# Altium schematic sheet Sheet.SchDoc: Ultrasonic Distance Meter
size A3; Date: 29.08.2025; Author: Olexandr Makedonskyi; CompanyName: AJAX; DrawnBy: Olexandr Makedonskyi; DocumentNumber: 1; Revision: 1.0; SheetNumber: 1; SheetTotal: 1
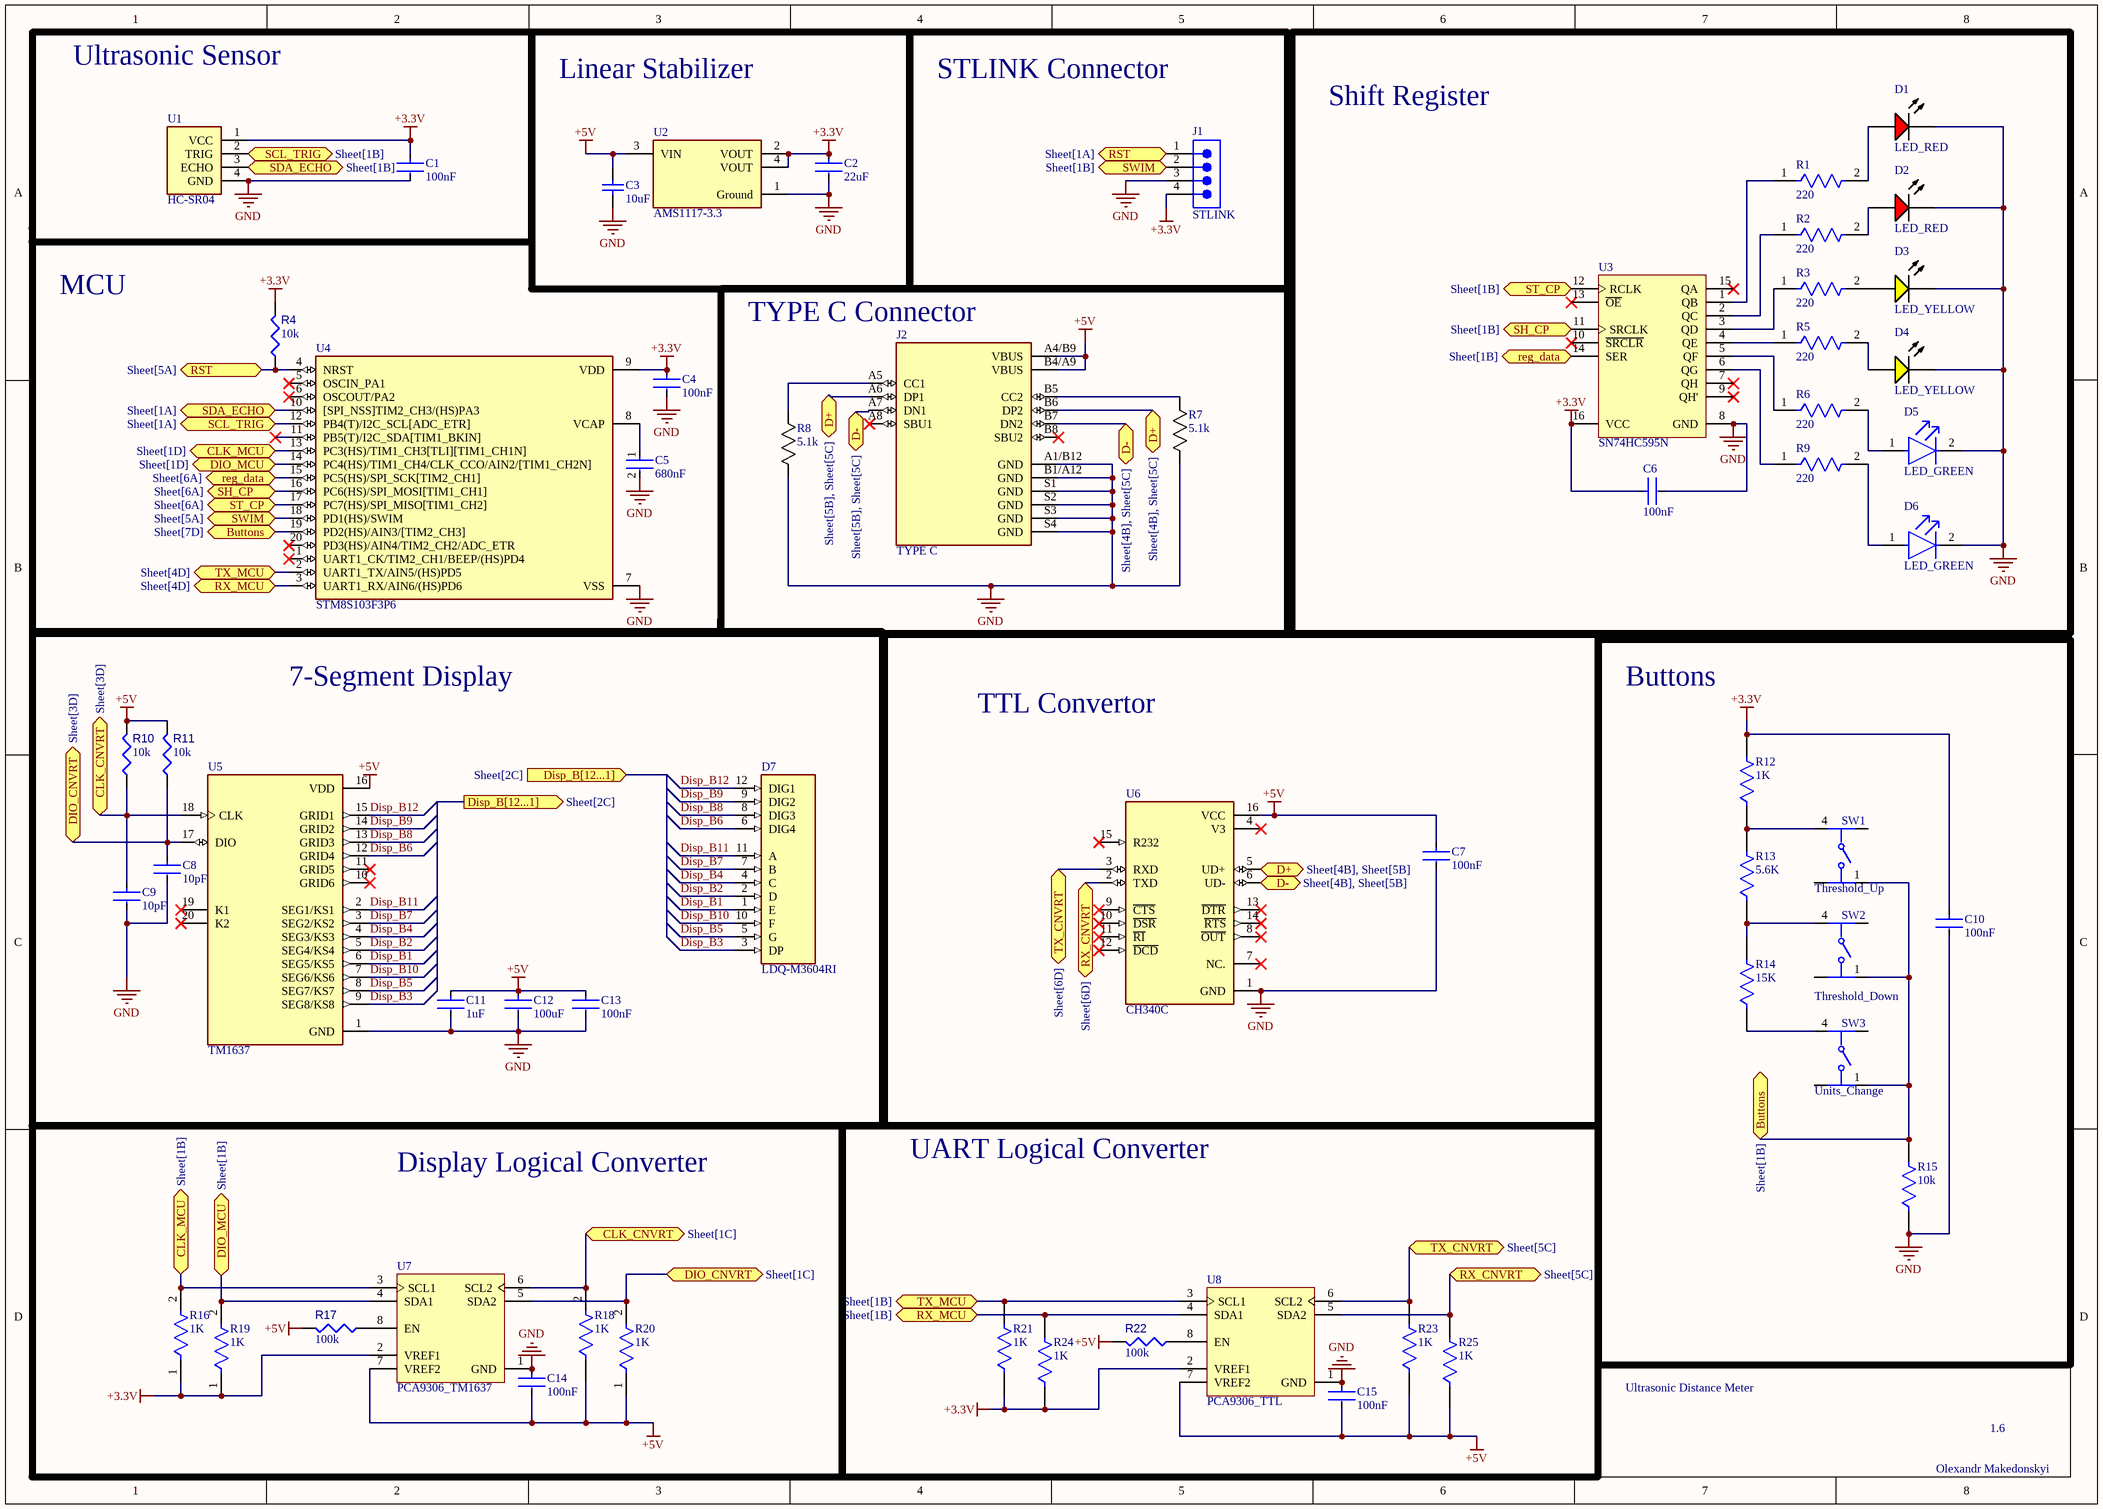
[diagram p0: Sheet.SchDoc]

## Parts
C1  100nF  [FP-C1206C-EB-MFG]
C2  22uF  [FP-1206-L_3_2_0_2-W_1_6_0-IPC_A]
C3  10uF  [CAPC1206(3216)190_L]
C4  100nF  [FP-C1206C-EB-MFG]
C5  680nF  [FP-CC1206-1_25-MFG]
C6  100nF  [FP-C1206C-EB-MFG]
C7  100nF  [FP-C1206C-EB-MFG]
C8  10pF  [FP-1206-L_3_2_0_2-W_1_6_0-IPC_C]
C9  10pF  [FP-1206-L_3_2_0_2-W_1_6_0-IPC_C]
C10  100nF  [FP-C1206C-EB-MFG]
C11  1uF  [FP-CC1206-FA-IPC_A]
C12  100uF  [FP-GRM31C-0_3-e0_3_0_8-MFG]
C13  100nF  [FP-C1206C-EB-MFG]
C14  100nF  [FP-C1206C-EB-MFG]
C15  100nF  [FP-C1206C-EB-MFG]
D1  LED_RED  [LUMX-SML-LX1206IC_V]
D2  LED_RED  [LUMX-SML-LX1206IC_V]
D3  LED_YELLOW  [LUMX-SML-LX1206YC-TR_V]
D4  LED_YELLOW  [LUMX-SML-LX1206YC-TR_V]
D5  LED_GREEN  [FP-SML-LX1206GC-TR-MFG]
D6  LED_GREEN  [FP-SML-LX1206GC-TR-MFG]
D7  LDQ-M3604RI  [LED_LDQ-M3604RI]
J1  STLINK  [61300411021]
J2  TYPE C  [GCT_USB4110GFA]
R1  220  [FP-SR1206-MFG]
R2  220  [FP-SR1206-MFG]
R3  220  [FP-SR1206-MFG]
R4  value 10k  [RESC3216X60X45ML15T20]  (hidden comment: Resistor 10k +/-1% 1206 250 mW)
R5  220  [FP-SR1206-MFG]
R6  220  [FP-SR1206-MFG]
R7  5.1k  [MCA 1206_VIS]
R8  5.1k  [MCA 1206_VIS]
R9  220  [FP-SR1206-MFG]
R10  value 10k  [RESC3216X60X45ML15T20]  (hidden comment: Resistor 10k +/-1% 1206 250 mW)
R11  value 10k  [RESC3216X60X45ML15T20]  (hidden comment: Resistor 10k +/-1% 1206 250 mW)
R12  1K  [FP-RMCF1206-IPC_A]
R13  5.6K  [FP-ESR18-IPC_C]
R14  15K  [FP-CRGCQ1206-IPC_C]
R15  10k  [FP-MCA1206-IPC_B]
R16  1K  [FP-RMCF1206-IPC_A]
R17  value 100k  [RESC3216X60X45ML15T20]  (hidden comment: Resistor 100k +/-1% 1206 250 mW)
R18  1K  [FP-RMCF1206-IPC_A]
R19  1K  [FP-RMCF1206-IPC_A]
R20  1K  [FP-RMCF1206-IPC_A]
R21  1K  [FP-RMCF1206-IPC_A]
R22  value 100k  [RESC3216X60X45ML15T20]  (hidden comment: Resistor 100k +/-1% 1206 250 mW)
R23  1K  [FP-RMCF1206-IPC_A]
R24  1K  [FP-RMCF1206-IPC_A]
R25  1K  [FP-RMCF1206-IPC_A]
SW1  (no value)  [FP-MJTP1230A-MFG]
SW2  (no value)  [FP-MJTP1230A-MFG]
SW3  (no value)  [FP-MJTP1230A-MFG]
U1  HC-SR04  [MODULE_4007]
U2  AMS1117-3.3  [FP-AMS1117-IPC_C]
U3  SN74HC595N  [DB0016A_M]
U4  STM8S103F3P6  [SOP65P640X120-20N]
U5  TM1637  [DIP778W43P254L2612H431Q20N]
U6  CH340C  [SOIC127P600X180-16N]
U7  PCA9306_TM1637  [DCT0008A_L]
U8  PCA9306_TTL  [DCT0008A_L]

## Blocks framed on the sheet
Ultrasonic Sensor: C1 U1
Linear Stabilizer: C2 C3 U2
STLINK Connector: J1
Shift Register: C6 D1-D6 R1-R3 R5 R6 R9 U3
TYPE C Connector: J2 R7 R8
7-Segment Display: C8 C9 C11-C13 D7 R10 R11 U5
TTL Convertor: C7 U6
Buttons: C10 R12-R15 SW1-SW3
Display Logical Converter: C14 R16-R20 U7
UART Logical Converter: C15 R21-R25 U8

## Ports
Buttons (bidir, see Sheet[1B]), Buttons (bidir, see Sheet[7D]), CLK_CNVRT (bidir, see Sheet[1C]), CLK_CNVRT (bidir, see Sheet[3D]), CLK_MCU (bidir, see Sheet[1B]), CLK_MCU (bidir, see Sheet[1D]), D+ (bidir, see Sheet[4B], Sheet[5B]), D+ (bidir, see Sheet[4B], Sheet[5C]), D+ (bidir, see Sheet[5B], Sheet[5C]), D- (bidir, see Sheet[4B], Sheet[5B]), D- (bidir, see Sheet[4B], Sheet[5C]), D- (bidir, see Sheet[5B], Sheet[5C]), DIO_CNVRT (bidir, see Sheet[1C]), DIO_CNVRT (bidir, see Sheet[3D]), DIO_MCU (bidir, see Sheet[1B]), DIO_MCU (bidir, see Sheet[1D]), Disp_B[12...1] (in, see Sheet[2C]), Disp_B[12...1] (out, see Sheet[2C]), reg_data (bidir, see Sheet[1B]), reg_data (bidir, see Sheet[6A]), RST (bidir, see Sheet[1A]), RST (bidir, see Sheet[5A]), RX_CNVRT (bidir, see Sheet[5C]), RX_CNVRT (bidir, see Sheet[6D]), RX_MCU (bidir, see Sheet[1B]), RX_MCU (bidir, see Sheet[4D]), SCL_TRIG (bidir, see Sheet[1A]), SCL_TRIG (bidir, see Sheet[1B]), SDA_ECHO (bidir, see Sheet[1A]), SDA_ECHO (bidir, see Sheet[1B]), SH_CP (bidir, see Sheet[1B]), SH_CP (bidir, see Sheet[6A]), ST_CP (bidir, see Sheet[1B]), ST_CP (bidir, see Sheet[6A]), SWIM (bidir, see Sheet[1B]), SWIM (bidir, see Sheet[5A]), TX_CNVRT (bidir, see Sheet[5C]), TX_CNVRT (bidir, see Sheet[6D]), TX_MCU (bidir, see Sheet[1B]), TX_MCU (bidir, see Sheet[4D])

## Nets
+3.3V: C1.1 C2.1 C4.1 C6.1 C10.1 J1.4 R4.2 R12.2 R16.1 R19.1 R21.1 R24.1 U1.1(VCC) U2.2(VOUT) U2.4(VOUT) U3.16(VCC) U4.9(VDD) U7.2(VREF1) U8.2(VREF1)
+5V: C3.2 C7.1 C11.1 C12.2 C13.1 C14.2 C15.2 J2.A4/B9(VBUS) J2.B4/A9(VBUS) R10.2 R11.2 R17.2 R18.1 R20.1 R22.2 R23.1 R25.1 U2.3(VIN) U5.16(VDD) U6.16(VCC) U7.7(VREF2) U8.7(VREF2)
GND: C1.2 C2.2 C3.1 C4.2 C5.2 C6.2 C7.2 C8.2 C9.2 C10.2 C11.2 C12.1 C13.2 C14.1 C15.1 D1.2(K) D2.2(K) D3.2(K) D4.2(K) D5.2(C) D6.2(C) J1.3 J2.A1/B12(GND) J2.B1/A12(GND) J2.S1(GND) J2.S2(GND) J2.S3(GND) J2.S4(GND) R7.1 R8.1 R15.1 U1.4(GND) U2.1(Ground) U3.8(GND) U4.7(VSS) U5.1(GND) U6.1(GND) U7.1(GND) U8.1(GND)
Buttons: R15.2 SW1.1 SW2.1 SW3.1 U4.19(PD2(HS)/AIN3/[TIM2_CH3]) ; port Buttons
CLK_CNVRT: C9.1 R10.1 R18.2 U5.18(CLK) U7.6(SCL2) ; port CLK_CNVRT
CLK_MCU: R16.2 U4.13(PC3(HS)/TIM1_CH3[TLI][TIM1_CH1N]) U7.3(SCL1) ; port CLK_MCU
D+: J2.A6(DP1) J2.B6(DP2) U6.5(UD+) ; port D+
D-: J2.A7(DN1) J2.B7(DN2) U6.6(UD-) ; port D-
DIO_CNVRT: C8.1 R11.1 R20.2 U5.17(DIO) U7.5(SDA2) ; port DIO_CNVRT
DIO_MCU: R19.2 U4.14(PC4(HS)/TIM1_CH4/CLK_CCO/AIN2/[TIM1_CH2N]) U7.4(SDA1) ; port DIO_MCU
Disp_B1: D7.1(E) U5.6(SEG5/KS5)
Disp_B2: D7.2(D) U5.5(SEG4/KS4)
Disp_B3: D7.3(DP) U5.9(SEG8/KS8)
Disp_B4: D7.4(C) U5.4(SEG3/KS3)
Disp_B5: D7.5(G) U5.8(SEG7/KS7)
Disp_B6: D7.6(DIG4) U5.12(GRID4)
Disp_B7: D7.7(B) U5.3(SEG2/KS2)
Disp_B8: D7.8(DIG3) U5.13(GRID3)
Disp_B9: D7.9(DIG2) U5.14(GRID2)
Disp_B10: D7.10(F) U5.7(SEG6/KS6)
Disp_B11: D7.11(A) U5.2(SEG1/KS1)
Disp_B12: D7.12(DIG1) U5.15(GRID1)
reg_data: U3.14(SER) U4.15(PC5(HS)/SPI_SCK[TIM2_CH1]) ; port reg_data
RST: J1.1 R4.1 U4.4(NRST) ; port RST
RX_CNVRT: R25.2 U6.2(TXD) U8.5(SDA2) ; port RX_CNVRT
RX_MCU: R24.2 U4.3(UART1_RX/AIN6/(HS)PD6) U8.4(SDA1) ; port RX_MCU
SCL_TRIG: U1.2(TRIG) U4.12(PB4(T)/I2C_SCL[ADC_ETR]) ; port SCL_TRIG
SDA_ECHO: U1.3(ECHO) U4.10([SPI_NSS]TIM2_CH3/(HS)PA3) ; port SDA_ECHO
SH_CP: U3.11(SRCLK) U4.16(PC6(HS)/SPI_MOSI[TIM1_CH1]) ; port SH_CP
ST_CP: U3.12(RCLK) U4.17(PC7(HS)/SPI_MISO[TIM1_CH2]) ; port ST_CP
SWIM: J1.2 U4.18(PD1(HS)/SWIM) ; port SWIM
TX_CNVRT: R23.2 U6.3(RXD) U8.6(SCL2) ; port TX_CNVRT
TX_MCU: R21.2 U4.2(UART1_TX/AIN5/(HS)PD5) U8.3(SCL1) ; port TX_MCU
NetC5_1: C5.1 U4.8(VCAP)
NetD1_1: D1.1(A) R1.2
NetD2_1: D2.1(A) R2.2
NetD3_1: D3.1(A) R3.2
NetD4_1: D4.1(A) R5.2
NetD5_1: D5.1(A) R6.2
NetD6_1: D6.1(A) R9.2
NetJ2_A5: J2.A5(CC1) R8.2
NetJ2_B5: J2.B5(CC2) R7.2
NetR1_1: R1.1 U3.1(QB)
NetR2_1: R2.1 U3.2(QC)
NetR3_1: R3.1 U3.3(QD)
NetR5_1: R5.1 U3.4(QE)
NetR6_1: R6.1 U3.5(QF)
NetR9_1: R9.1 U3.6(QG)
NetR12_1: R12.1 R13.2 SW1.4
NetR13_1: R13.1 R14.2 SW2.4
NetR14_1: R14.1 SW3.4
NetR17_1: R17.1 U7.8(EN)
NetR22_1: R22.1 U8.8(EN)

Not connected (* = marked no-connect by the designer): J2 A8(SBU1)* B8(SBU2)*; SW1 2 3; SW2 2 3; SW3 2 3; U3 7(QH)* 9(QH')* 10(~{SRCLR})* 13(~{OE})* 15(QA)*; U4 1(UART1_CK/TIM2_CH1/BEEP/(HS)PD4)* 5(OSCIN_PA1)* 6(OSCOUT/PA2)* 11(PB5(T)/I2C_SDA[TIM1_BKIN])* 20(PD3(HS)/AIN4/TIM2_CH2/ADC_ETR)*; U5 10(GRID6)* 11(GRID5)* 19(K1)* 20(K2)*; U6 4(V3)* 7(NC.)* 8(~{OUT})* 9(~{CTS})* 10(~{DSR})* 11(~{RI})* 12(~{DCD})* 13(~{DTR})* 14(~{RTS})* 15(R232)*

## Notes on the sheet
- MCU
- (near SW1) Threshold_Up
- (near SW2) Threshold_Down
- (near SW3) Units_Change
- Ultrasonic Distance Meter
- 1.6
- Olexandr Makedonskyi

## Library data of the parts
C1 C4 C6 C7 C10 C13-C15 = CMP-03020-029382-1: C1206 0.10 μF X8R 2.00% 16 V; Manufacturer Part Number: C1206C104G4HACAUTO; Manufacturer: KEMET; Automotive Grade: Grade 0; Capacitance: 0.10 μF; Voltage Rating: 16 V; Value: 0.10 μF; Temperature Coefficient: 15%; Tolerance: 0.02; Material: Ceramic; Device Class L3: Ceramic Capacitors; Lead Free: Yes; Ipc Land Pattern Name: CAPC320160X78; RoHS: TRUE; Automotive: Yes; Package: C1206C-EB; Octopart: https://octopart.com/c1206c104g4hacauto-kemet-88099309; Temperature Range Low: -55°C; ComponentLink2URL: https://content.kemet.com/datasheets/KEM_C1007_X8R_ULTRA_150C_SMD.pdf; Device Class L2: Capacitors; Temperature: -55°C to +150°C; ComponentLink2Description: Datasheet; Category: Cap; Temperature Range High: +150°C; Device Class L1: Passive Components; Height: 0.88mm; Temperature Characteristic: X8R
C2 = CMP-04427-020232-1: General Purpose Ceramic Capacitor, 1206, 22uF, 20%, X7R, 15%, 6.3V; Dissipation Factor: 5%; Width: 0.063inch; Min Operating Temperature: -55°C; Mount: Surface Mount; Case Code (Metric): 3216; Case/Package: 1206; Voltage Rating (DC): 6.3V; Package Quantity: 2500; RoHS Compliant: Yes; Depth: 1.6mm; Termination: SMD/SMT; Length: 3.2mm; Radiation Hardening: No; Max Operating Temperature: 125°C; Packaging: Tape and Reel; Voltage Rating: 6.3V; Construction: Flat; REACH SVHC: No SVHC; Case Code (Imperial): 1206; Lead Free: Lead Free; Height: 1.78mm; Capacitance: 22uF; Tolerance: 20%; Dielectric: X7R; Thickness: 0.07inch; Number of Pins: 2
C3 = CMP-1037-04978-1: CAP 10uF 16V -20% to +80% 1206 (3216 Metric) Thickness 1.9mm SMD; Case-EIA: 1206; Case-Metric: 3216; Tolerance: -20% to +80%; Technology: SMT; Value: 10uF; Rated Voltage: 16 V; Max Thickness: 1.9 mm
C5 = CMP-03422-000845-1: CAP CER 0.68UF 50V X7R 1206; Manufacturer: Yageo; Manufacturer Part Number: CC1206KKX7R9BB684; Automotive Grade: NA; Material: Ceramic; Tolerance: 0.1; Temperature Coefficient: 15%; Category: Cap; Footprint Url: http://www.yageo.com/exep/pages/download/literatures/UPY-C_GEN_24.pdf; Octopart: https://octopart.com/cc1206kkx7r9bb684-yageo-71334650; Device Class L2: Capacitors; Digikey Description: CAP CER 0.68UF 50V X7R 1206; Device Class L1: Passive Components; Temperature: -55°C to +125°C; Capacitance: 680 nF; Temperature Characteristic: X7R; ComponentLink2URL: http://www.yageo.com/documents/recent/UPY-NP0X7R_HV_1KV-to-3KV_11.pdf; Mouser Description: Cap Ceramic 0.68uF 50V X7R 10% Pad SMD 1206 125C T/R; Height: 1.45mm; Lead Free: Yes; Device Class L3: Ceramic Capacitors; ComponentLink2Description: Datasheet; Temperature Range High: +125°C; Package: CC1206-1.25; Voltage Rating: 50 V; Temperature Range Low: -55°C; Automotive: No; RoHS: TRUE; Value: 680 nF
C8 C9 = CMP-04427-003168-1: Automotive Ceramic Capacitor, 1206, 10pF, 5%, NP0, 30ppm/°C, 500V; Dielectric: C0G; Case/Package: 1206; Termination: SMD/SMT; Package Quantity: 4000; Max Operating Temperature: 125°C; Length: 3.2mm; RoHS Compliant: Yes; Height: 0.5mm; Tolerance: 5%; Capacitance: 10pF; Packaging: Tape and Reel; Case Code (Imperial): 1206; Voltage Rating: 500V; Width: 1.6mm; Voltage Rating (DC): 500V; Case Code (Metric): 3216; Min Operating Temperature: -55°C
C11 = CMP-03422-000449-2: CAP CER X5R 1206; RoHS Compliant: Yes
C12 = CMP-06035-034850-1: Chip Multilayer Ceramic Capacitors for General Purpose, 1206, 100uF, X5R, 15%, 20%, 6.3V
D1 D2 = CMP-2000-07123-1: LED Red, 65 mW, -40 to 85 degC, 2-Pin SMD, RoHS, Tape and Reel; Manufacturer: Lumex; Part No: SML-LX1206IC-TR; LED Material: GaAsP; Peak Wavelength: 635nm; Number of LEDs: 1; Viewing Angle: 160; Reverse Voltage: 5(Min)V; Lens Appearance: ColorlessNonDiffused; Intensity: 6mcd; Type: Uni-Color; Pin_Count: 2; Lens Dimensions: 2x1.6x0.5mm; Mounting: SurfaceMount; ECCN: EAR99; RoHS: Unknown; Package Description: 2-Pin Surface Mount Device, Body 3.2 x 1.5 mm; Mounting Technology: SurfaceMount; Dominant Wavelength: N/A; Supplier_Package: SMD; Supplier Standard Pack: 3,000; Color: Red; Dimension: 3.2x1.6x1.1mm; HTS: 8541402000; Family: SML-LX1206IC; Supplier: Lumex; Datasheet URL: http://www.lumex.com/content/files/ProductAttachment/SML-LX1206IC-TR.pdf; Package Reference: SML-LX1206IC; Manufacturer URL: http://www.lumexinstruments.com/; Operating Temperature: -25to85C; Packaging: TapeandReel; Datasheet Version: Rev. J, 08/2012
D3 D4 = CMP-2000-07124-1: Yellow LED, Water Clear Len, 585 nm, 2.1 V, -40 to 85 degC, 2-Pin SMD, RoHS, Tape and Reel; Manufacturer: Lumex; Product Training Modules: LEDsBenefitsofCustomLEDandLCDTechnology; Millicandela Rating: 6mcd; Catalog Drawings: SML-LX1206SeriesTopSML-LX1206SeriesSideSML-LX1206SeriesBottomSML-LX1206SeriesFootprint; Wavelength - Peak: 585nm; Other Names: 67-1358-2LU60357TRSMLLX1206YCTR; Lens Style/Size: RectanglewithFlatTop; Current - Test: 20mA; Lens Color: Colorless; Viewing Angle: 160°; Voltage - Forward (Vf) (Typ): 2.1V; Online Catalog: SML-LX1206RectanglewithFlatTop1206PackageLEDs; Mounting Type: SurfaceMount; Package Description: 2-Pin Surface Mount Device, Body 3.2 x 1.5 mm; Datasheet Version: Rev. K, 08/2012; Features: -; Color: Yellow; RoHS Information: RoHSCertofCompliance; Package Reference: SML-LX1206YC-TR; Supplier Device Package: 1206; Standard Package: 3,000; Series: -; Wavelength - Dominant: -; Package / Case: 1206(3216Metric); Mounting Technology: SurfaceMount; Height (Max): 1.10mm; Lens Transparency: Clear; Datasheet URL: http://www.lumex.com/content/files/ProductAttachment/SML-LX1206YC-TR.pdf; Family: LEDIndication-Discrete; Manufacturer URL: http://www.lumexinstruments.com/; Packaging: Tape&Reel(TR); Category: Optoelectronics; Size / Dimension: 3.20mmLx1.60mmW
D5 D6 = CMP-2000-07122-2: LED GREEN CLEAR 1206 SMD; Test Current: 20mA; Luminous Intensity: 10mcd; Forward Voltage: 2.2V; Viewing Angle: 160°; Lens Color: Colorless; Approvals: UL; Dominant Wavelength: 565nm; Current Rating: 25mA; Number of LEDs: 1; Power Rating: 65mW; Lens Style: Rectangular; Length: 3.2mm; Mount: Surface Mount; Package Quantity: 1; Forward Current: 20mA; Case/Package: 1206; Lead Free: Lead Free; Case Code (Imperial): 1206; Max Operating Temperature: 85°C; REACH SVHC: No SVHC; RoHS Compliant: Yes; Number of Pins: 2; Illumination Color: Green; Width: 1.6mm; Packaging: Tape and Reel; Wavelength: 565nm; Lens Transparency: Clear; Height: 1.1mm; Color: Green; Min Operating Temperature: -40°C; Case Code (Metric): 3216
D7 = CMP-004-00032-1: Display, Seven Segment, 9.2MM, Red; MF: Lumex; Value: *; Pins: 12; Source: LDQ-M3604RI.SchLib; MP: LDQ-M3604RI; SnapEDA_Link: https://www.snapeda.com/parts/LDQ-M3604RI/Lumex/view-part/?ref=snap; Component Type: Standard; Case/Package: None; Design Item ID: LDQ-M3604RI; Check_prices: https://www.snapeda.com/parts/LDQ-M3604RI/Lumex/view-part/?ref=eda
J1 = CMP-007-000000-1: NexarPartId: 31153320; Number of Positions: 4; Connector Type: Male Pin; Gender: Male; Current Rating: 3A; Pitch: 2.54mm; Contact Resistance: 20m?; Operating Supply Voltage: 250V; REACH SVHC: Unknown; Contact Mating Length: 5.9944mm; Termination: Solder; Pin Count: 4; Mount: Through Hole; Number of Rows: 1; Number of Pins: 4; Contact Material: Copper; Color: Black; Contact Plating: Gold; Design Item ID: CMP-1502-01063-3; Component Type: Standard; Source: Components - 25.08.25 - 11.48.SchLib; RoHS: Compliant; Lead Pitch: 2.54mm; Number of Contacts: 4
J2 = CMP-002-00071-1: USB-C (USB TYPE-C) USB 2.0 Receptacle Connector 24 (16+8 Dummy) Position Surface Mount, Right Angle; MF: Global Connector Technology; Check_prices: https://www.snapeda.com/parts/USB4110GFA/Global+Connector+Technology/view-part/?ref=eda; Case/Package: None; Component Type: Standard; Source: USB4110GFA.SchLib; Pins: 16; SnapEDA_Link: https://www.snapeda.com/parts/USB4110GFA/Global+Connector+Technology/view-part/?ref=snap; Value: *; MP: USB4110GFA; Design Item ID: USB4110GFA
R1-R3 R5 R6 R9 = CMP-03412-006046-1: RES SMD 220 OHM 1% 1/2W 1206; Manufacturer Part Number: SR1206FR-7W220RL; Manufacturer: Yageo; Voltage Rating: 200V; Value: 220Ω; Power Rating: 0.5W; Automotive Grade: Grade 0; Tolerance: 0.01; Lead Free: Yes; Category: Res; Footprint Url: http://www.yageo.com/exep/pages/download/literatures/PYu-R_Mount_10.pdf; ComponentLink2URL: http://www.yageo.com/documents/recent/PYu-SR_D_F%20tol_RoHS_L_3.pdf; Octopart: https://octopart.com/sr1206fr-7w220rl-yageo-71414967; Height: 0.65mm; ComponentLink2Description: Datasheet; Temperature Range High: +155°C; Ipc Land Pattern Name: RESC310160X55; Resistance: 220Ω; Temperature Range Low: -55°C; Device Class L3: Chip SMD Resistors; Device Class L1: Passive Components; Composition: Thick Film; Package: SR1206; Series: SR; Device Class L2: Resistors; Temperature: -55°C to +155°C; RoHS: TRUE; Digikey Description: RES SMD 220 OHM 1% 1/2W 1206; Automotive: Yes
R4 R10 R11 = CMP-009-00016-5: Chip Resistor, 10 KOhm, +/- 1%, 0.25 W, -55 to 155 degC, 1206 (3216 Metric); Power: 250mW; Voltage Rating: 200V; Pins: 2; Max Operating Temperature: 155°C; Tolerance: 1%; RoHS Compliant: True; Case/Package: 1206; Min Operating Temperature: -55°C; Mounting Technology: SM
R7 R8 = CMP-00030-45006818-1: MCA12060D5101BP100 MCA Series Precision Thin Film Chip Resistor 1206 5.1K Ohm 0.1% Tolerance 0.25W ±25 ppm/K Surface Mount 2-Pin SMD...; Resistance: 5.1kΩ; Max Power Dissipation: 250mW; Voltage Rating: 200V; Temperature Coefficient: 25ppm/°C; Min Operating Temperature: -55°C; Depth: 1.6mm; Max Operating Temperature: 125°C; Tolerance: 0.1%; Lead Free: Lead Free; NexarPartId: 45006818; Power Rating: 250mW; Length: 3.2004mm; Case/Package: 1206; Military Standard: Not; Height: 650µm; Composition: Thin Film; Packaging: Tape & Reel (TR); RoHS: Compliant; Width: 1.6002mm; Number of Terminations: 2
R12 R16 R18-R21 R23-R25 = CMP-26527-006126-1: 1kΩ ±5% 0.25W 1206 Thick Film Chip Resistor AEC-Q200 compliant; Resistance: 1kR; Max Power Dissipation: 250mW; Temperature Coefficient: 200ppm/°C; Resistor Type: Thick Film; Height: 0.028inch; Max Operating Temperature: 155°C; Features: Automotive AEC-Q200; Case/Package: 1206; Mount: Surface Mount; Series: RMCF; Min Operating Temperature: -55°C; Packaging: Tape and Reel; Contact Plating: Tin; Length: 0.126inch; Number of Terminations: 2; Radiation Hardening: No; Width: 0.063inch; Case Code (Metric): 3216; Case Code (Imperial): 1206; RoHS Compliant: Yes; Tolerance: 5%
R13 = CMP-08839-028664-1: 5.6kΩ ±1% 0.5W 1206 Anti-Surge Chip Resistor AEC-Q200; Temperature Coefficient: 100ppm/°C; Resistance: 5.6kR; Max Power Dissipation: 500mW; Tolerance: 1%; Case/Package: 1206; Packaging: Tape and Reel; Series: ESR; Features: Automotive AEC-Q200; Max Operating Temperature: 155°C; Resistor Type: Thick Film; Min Operating Temperature: -55°C; RoHS Compliant: Yes; Number of Terminations: 2
R14 = CMP-03211-002524-1: CRGCQ1206 15KΩ 0.25W 5% ±100ppm/°C 200V; Manufacturer Part Number: CRGCQ1206J15K; Manufacturer: TE Connectivity; Automotive Grade: Grade 950; Tolerance: 0.05; ComponentLink2Description: Datasheet; Temperature: -55°C to +155°C; Category: Res; Automotive: Yes; Temperature Range High: +155°C; Power Rating: 0.25W; Composition: Thick Film; Temperature Coefficient: ±100ppm/°C; Ipc Land Pattern Name: RESC310155X55; Ambient Temperature Range High: +70°C; Lead Free: Yes; Temperature Range Low: -55°C; RoHS: TRUE; Device Class L2: Resistors; Device Class L1: Passive Components; Height: 0.65mm; Value: 15KΩ; ComponentLink2URL: https://www.te.com/commerce/DocumentDelivery/DDEController?Action=showdoc&DocId=Data+Sheet%7F1773204-3%7F1%7Fpdf%7FEnglish%7FENG_DS_1773204-3_1.pdf%7F4-2176347-959; Voltage Rating: 200V; Resistance: 15KΩ; Package: CRGCQ1206; Device Class L3: Chip SMD Resistors; Series: CRGCQ; Octopart: https://octopart.com/crgcq1206j15k-te+connectivity-91018310
R15 = CMP-02407-011266-1: Res MC AT Professional Thin Film 1206 10kΩ 0.5% 0.4W ±25ppm/°C Molded Paper T/R; Resistance: 10kR; Voltage Rating: 200V; Max Power Dissipation: 400mW; Weight: 0.000325oz; Height: 0.55mm; Case Code (Imperial): 1206; Packaging: Tape and Reel; Series: MCA AT - Professional; Width: 1.6mm; Resistor Type: Thin Film; Tolerance: 0.5%; Max Operating Temperature: 175°C; Termination: SMD/SMT; Min Operating Temperature: -55°C; Temperature Coefficient: 25ppm/°C; Number of Terminations: 2; Length: 3.2mm; RoHS Compliant: Yes; Case Code (Metric): 3216; Case/Package: 1206; Features: Automotive AEC-Q200; Power Rating: 400mW
R17 R22 = CMP-009-00025-5: Chip Resistor, 100 KOhm, +/- 1%, 0.25 W, -55 to 155 degC, 1206 (3216 Metric); Voltage Rating: 200V; Power: 250mW; RoHS Compliant: True; Max Operating Temperature: 155°C; Pins: 2; Tolerance: 1%; Mounting Technology: SM; Case/Package: 1206; Min Operating Temperature: -55°C
SW1-SW3 = CMP-47024-000004-1: SWITCH TACTILE SPST-NO 0.05A 12V; Mechanical Life: 100000Cycles; Throw Configuration: SPST; Actuator Length: 1.4mm; Switch Travel: 0.25mm; Actuator Color: Black; Operating Force: 160gf; Contact Resistance: 100mR; Actuator Type: Standard; Switch Function: Off-Mom; Actuator Material: Thermoplastic; Illumination Type: Non-Illuminated; Current Rating: 50mA; Min Operating Temperature: -20°C; Series: MJTP; Electrical Life: 100000Cycles; Mount: Through Hole; Packaging: Bulk; Color: Black; Package Quantity: 2000; Voltage Rating (DC): 12V; REACH SVHC: No SVHC; Orientation: Straight; Termination: PC Pin; Contact Material: Bronze; RoHS Compliant: Yes; Max Voltage Rating (DC): 12V; Max Operating Temperature: 70°C; Contact Plating: Silver
U1 = CMP-015-000000-5: Ultrasonic Distance Sensor - 3V or 5V - HC-SR04 compatible - RCWL-1601; MF: Adafruit Industries; SnapEDA_Link: https://www.snapeda.com/parts/4007/Adafruit+Industries+LLC/view-part/?ref=snap; MP: 4007; Check_prices: https://www.snapeda.com/parts/4007/Adafruit+Industries+LLC/view-part/?ref=eda; Pin Count: 4; Component Type: Standard; Design Item ID: 4007; Package: None; Value: *; Source: 4007.SchLib
U2 = CMP-209535-000001-1: LDO Voltage Regulators 1A, 3.3V; Manufacturer: Advanced Monolithic Systems; Dropout Voltage: 1.1V; Output Type: Fixed; Nominal Supply Current: 5mA; Max Power Dissipation: 1.2W; Max Supply Voltage: 15V; Number Of Outputs: 1; Standoff Height: 0.64mm; Max Junction Temp: +125°C; Height: 1.8mm; Package: AMS1117; Device Class L2: Power Management ICs; ComponentLink2Description: Datasheet; ComponentLink2URL: http://www.advanced-monolithic.com/pdf/ds1117.pdf; Category: IC; RoHS: TRUE; Automotive: No; Device Class L1: Integrated Circuits (ICs); Output Current: 1A; Device Class L3: Voltage Regulators - Linear; Temperature: -40°C to +125°C; Output Voltage: 3.3V; Manufacturer Part Number: AMS1117-3.3; Temperature Range Low: -40°C; Octopart: https://octopart.com/ams1117-3.3-advanced+monolithic+systems-25899300; Lead Free: Yes; Ipc Land Pattern Name: SOT229P700X180-4; Temperature Range High: +125°C
U3 = CMP-0780-00077-3: 8-Bit Shift Registers With 3-State Output Registers, DB0016A, LARGE T&R; Manufacturer: Texas Instruments; F @ Nom Voltage(Max)(Mhz): 28; tpd @ Nom Voltage(Max)(ns): 34; Input Type: CMOS; Rating: Military; VCC(Min)(V): 2; Voltage(Nom)(V): 6; 3-State Output: Yes; ICC @ Nom Voltage(Max)(mA): 0.08; Technology Family: HC; Output Drive (IOL/IOH)(Max)(mA): 7.8/-7.8; PackageReference: DB0016A; PackageVersion: http://www.ti.com/lit/ml/mpds507/mpds507.pdf; Output Type: CMOS; Code_JEDEC: MO-150; VCC(Max)(V): 6; Operating Temperature Range(C): -40 to 85; DatasheetVersion: SCLS041H; Generic Part Number: SN74HC595
U4 = CMP-031-00006-1: STM8 series Microcontroller IC 8-Bit 16MHz 8KB (8K x 8) FLASH 20-TSSOP; MF: STMicroelectronics; Check_prices: https://www.snapeda.com/parts/STM8S103F3P6/STMicroelectronics/view-part/?ref=eda; Value: *; Design Item ID: STM8S103F3P6; Component Type: Standard; SnapEDA_Link: https://www.snapeda.com/parts/STM8S103F3P6/STMicroelectronics/view-part/?ref=snap; Case/Package: TSSOP-20 STMicroelectronics; MP: STM8S103F3P6; Pins: 20; Source: STM8S103F3P6.SchLib
U5 = CMP-005-000000-1: LED Drive Control Special Circuit; MF: Titan Micro Electronics; Check_prices: https://www.snapeda.com/parts/TM1637/Titan+Micro+Electronics/view-part/?ref=eda; Package: None; Source: TM1637.SchLib; SnapEDA_Link: https://www.snapeda.com/parts/TM1637/Titan+Micro+Electronics/view-part/?ref=snap; Design Item ID: TM1637; Component Type: Standard; Pin Count: 20; Value: *; MP: TM1637
U6 = CMP-030-000000-1: USB to serial chip CH340; MF: WCH; SnapEDA_Link: https://www.snapeda.com/parts/CH340C/WCH/view-part/?ref=snap; Package: None; Pin Count: 16; Design Item ID: CH340C; Value: *; Availability: Not in stock; Price: None; Check_prices: https://www.snapeda.com/parts/CH340C/WCH/view-part/?ref=eda; MP: CH340C; Component Type: Standard; Source: CH340C.SchLib
U7 U8 = CMP-0314-00283-2: Dual Bi-Directional I2C-Bus and SMBus Voltage Level-Translator, 0 to 5.5 V, -40 to 85 degC, 8-pin SM8 (DCT), Green (RoHS & no Sb/Br); PartNumber: PCA9306DCTR; Manufacturer: Texas Instruments; Enable Pin: Yes; Function: Voltage Translator; tpd max(ns): 1.5; Rating: Catalog; SubFamily: I2C Special Function; Max Frequency(kHz): 400; Vcc range(V): 0 to 5.5; No. of Outputs: 2; Eco-Plan: Green (RoHS & no Sb/Br); Mounting Technology: Surface Mount; 5V Tolerant I/O: Yes; ComponentLink2Description: Package Specification; ComponentLink1Description: Datasheet; On-Chip Power-on-Reset: No; PackageVersion: revC, Sep-2002; DatasheetVersion: SCPS113J; PackageDescription: 8-Pin Thin Small Outline Package 3 x 2.8 mm Body ,0.65 mm Pitch; Open Drain I/O Type: Yes; ComponentLink1URL: http://www.ti.com/general/docs/lit/getliterature.tsp?genericPartNumber=PCA9306&fileType=pdf; Code_JEDEC: MO-187-DA; PackageReference: DCT0008A; ComponentLink2URL: http://www.ti.com/litv/pdf/mpds049b; fSCLK(Max)(MHz): 400